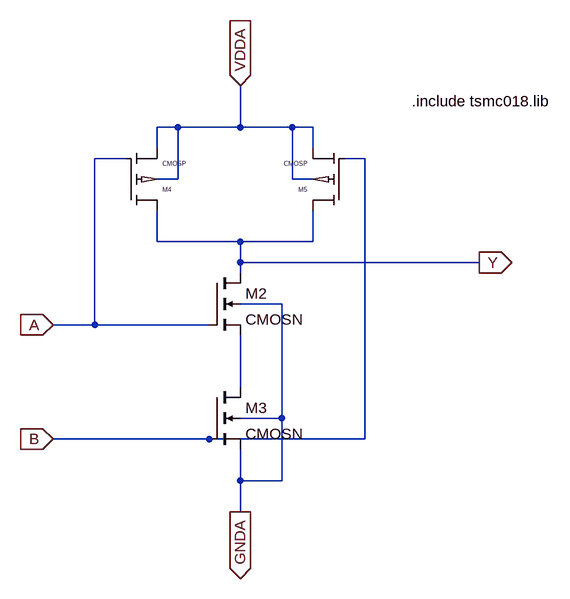
[diagram p0: schematic Nand.asc]
Nand.asc, the LTspice schematic file:
Version 4
SHEET 1 880 1620
WIRE 80 112 48 112
WIRE 176 112 176 48
WIRE 176 112 80 112
WIRE 256 112 176 112
WIRE 288 112 256 112
WIRE 48 144 48 112
WIRE 288 144 288 112
WIRE 0 160 -48 160
WIRE 368 160 336 160
WIRE 80 192 80 112
WIRE 80 192 48 192
WIRE 256 192 256 112
WIRE 288 192 256 192
WIRE 48 288 48 240
WIRE 176 288 48 288
WIRE 288 288 288 240
WIRE 288 288 176 288
WIRE 176 320 176 288
WIRE 544 320 176 320
WIRE 176 336 176 320
WIRE 240 384 176 384
WIRE -48 416 -48 160
WIRE -48 416 -112 416
WIRE 128 416 -48 416
WIRE 176 512 176 432
WIRE 240 560 240 384
WIRE 240 560 176 560
WIRE 128 592 -112 592
WIRE 368 592 368 160
WIRE 368 592 128 592
WIRE 176 656 176 608
WIRE 240 656 240 560
WIRE 240 656 176 656
WIRE 176 704 176 656
FLAG 176 48 VDDA
IOPIN 176 48 In
FLAG 176 704 GNDA
IOPIN 176 704 Out
FLAG -112 416 A
IOPIN -112 416 In
FLAG -112 592 B
IOPIN -112 592 In
FLAG 544 320 Y
IOPIN 544 320 Out
SYMBOL cmosn 128 336 R0
SYMATTR InstName M2
SYMATTR Value2 l=180n w=2u
SYMBOL cmosn 128 512 R0
SYMATTR InstName M3
SYMATTR Value2 l=180n w=2u
SYMBOL cmosp 0 240 M180
SYMATTR InstName M4
SYMATTR Value2 l=180n w=5u
SYMBOL cmosp 336 240 R180
SYMATTR InstName M5
SYMATTR Value2 l=180n w=5u
TEXT 440 72 Left 2 !.include tsmc018.lib

The netlist it stands for:
* Nand.asc
M2 Y A N001 GNDA CMOSN l=180n w=2u
M3 N001 B GNDA GNDA CMOSN l=180n w=2u
M4 Y A VDDA VDDA CMOSP l=180n w=5u
M5 Y B VDDA VDDA CMOSP l=180n w=5u
.model NMOS NMOS
.model PMOS PMOS
.lib standard.mos
.include tsmc018.lib
.lib tsmc018.lib
.backanno
.end